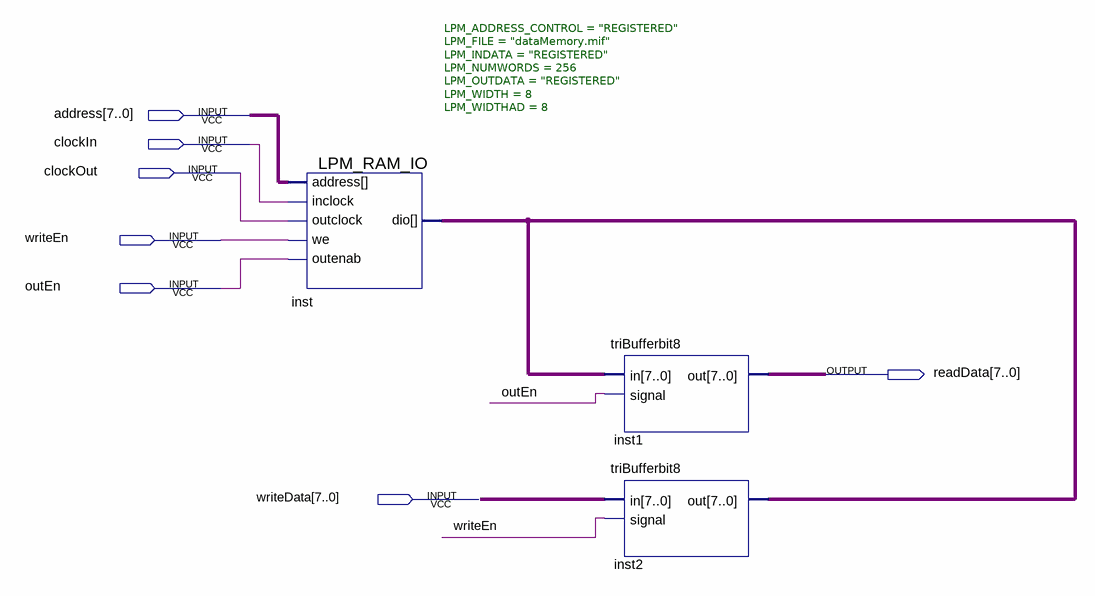
[diagram p0: schematic sheet]
// Quartus schematic dCache.bdf as structural Verilog: 3 symbols, 7 pins
module dCache (
  input  [7:0] address,
  input  clockIn,
  input  clockOut,
  input  writeEn,
  input  outEn,
  input  [7:0] writeData,
  output [7:0] readData
);

  wire [7:0] inst_dio;

  LPM_RAM_IO #(.LPM_ADDRESS_CONTROL("REGISTERED"), .LPM_FILE("dataMemory.mif"), .LPM_INDATA("REGISTERED"), .LPM_NUMWORDS(256), .LPM_OUTDATA("REGISTERED"), .LPM_WIDTH(8), .LPM_WIDTHAD(8)) inst (
    .address(address), .inclock(clockIn), .outclock(clockOut), .outenab(outEn), .we(writeEn), .dio(inst_dio));
  triBufferbit8 inst1 (.in(inst_dio), .signal(outEn), .out(readData));
  triBufferbit8 inst2 (.in(writeData), .signal(writeEn), .out(inst_dio));
endmodule
